# EAGLE design 202_9axis (EAGLE 9.6.2)
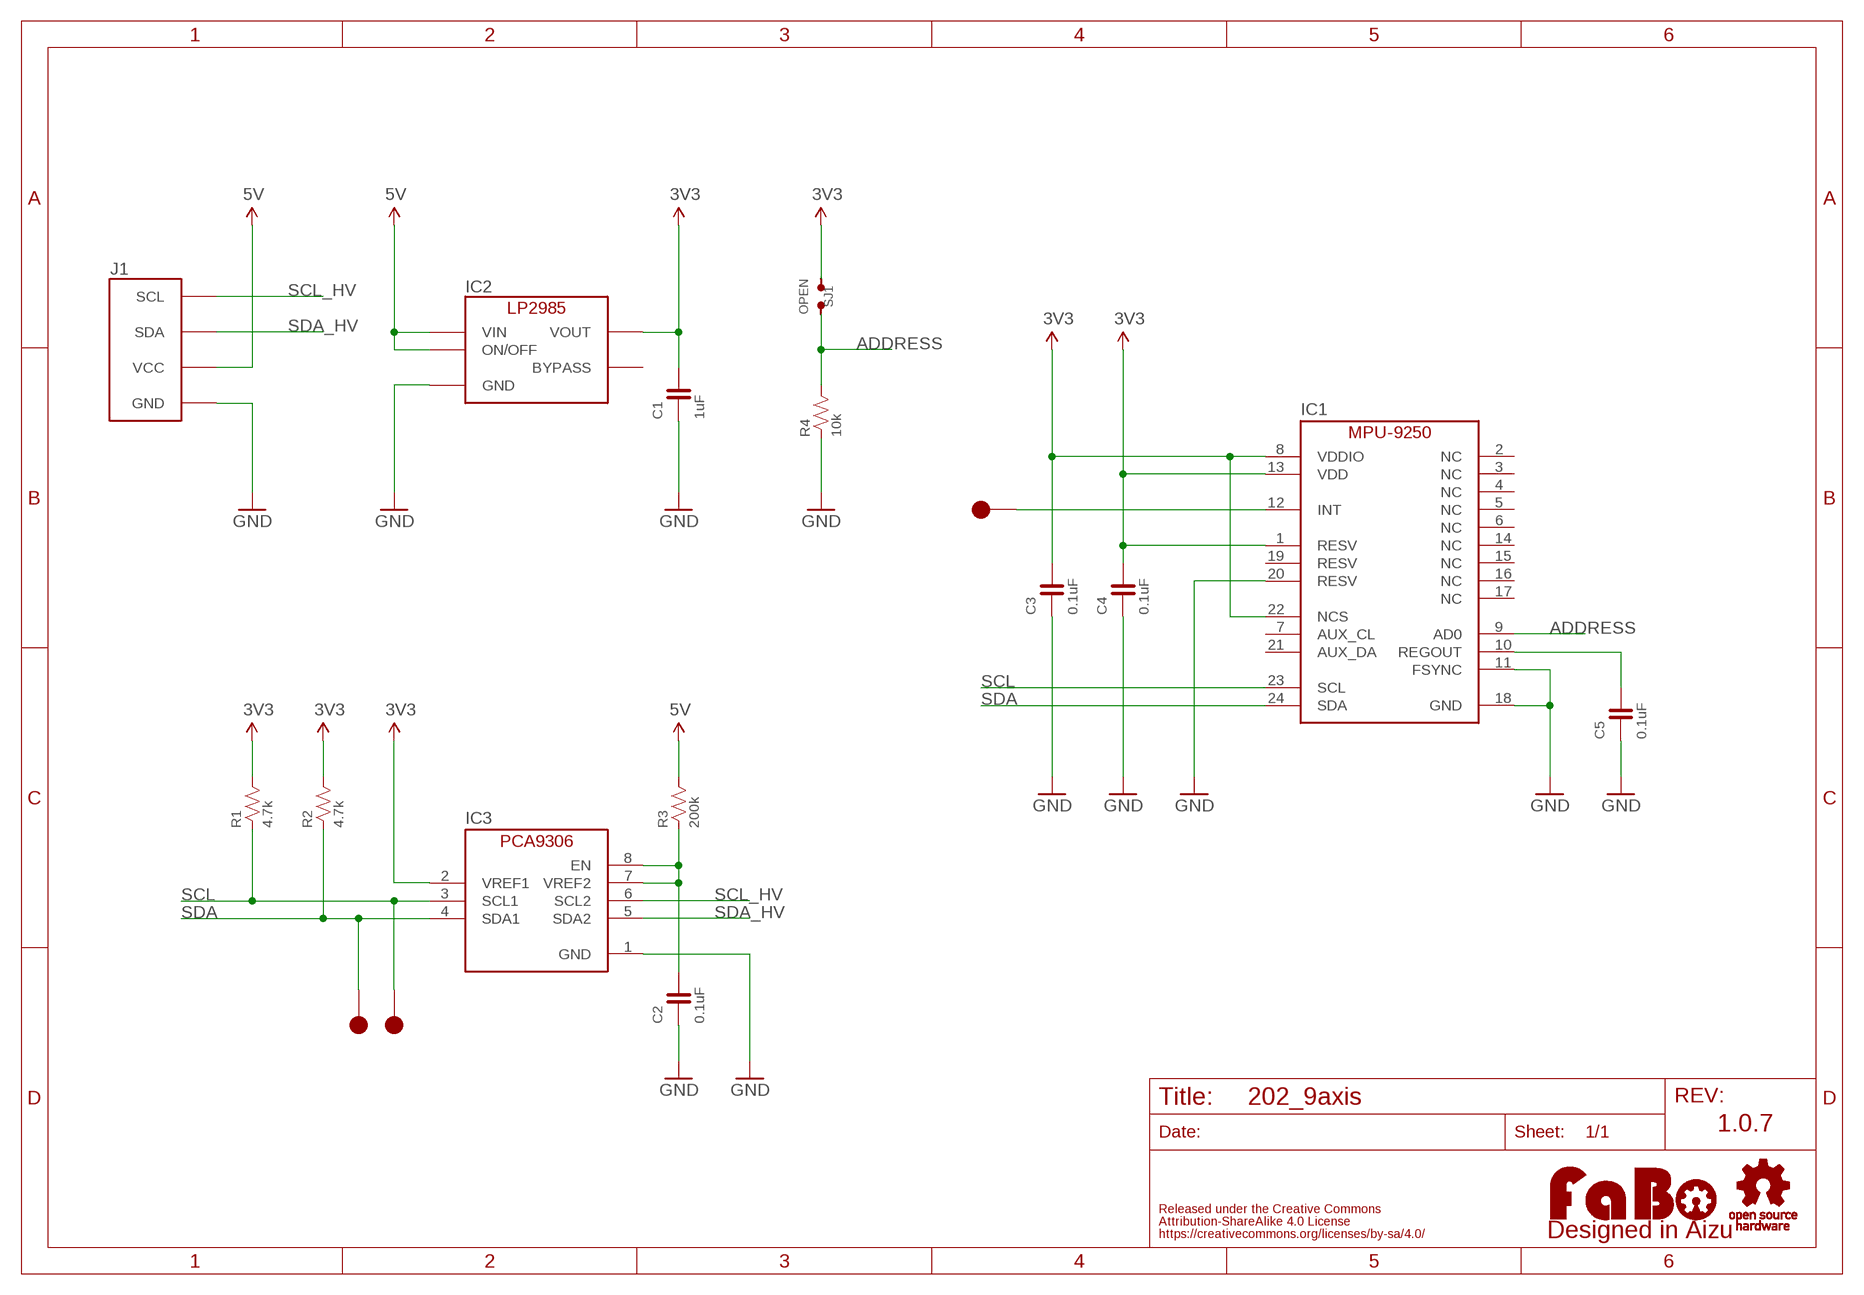
[diagram p0: schematic, sheet 1]

## Parts
C1  1uF  CAPACITOR-0603  [0603]
C2  0.1uF  CAPACITOR-0603  [0603]
C3  0.1uF  CAPACITOR-0603  [0603]
C4  0.1uF  CAPACITOR-0603  [0603]
C5  0.1uF  CAPACITOR-0603  [0603]
IC1  IS-MPU9250  [INVENSENSE-MPU9250]
IC2  LP2985-33DBV  [SOT-23-5]
IC3  PCA9306GM  [XQFN8]
J1  FABO_BRICK_I2C  [FABO_BRICK_I2C]
LOGO1  LOGO_FABO-M  [LOGO_FABO_M]
R1  4.7k  RESISTOR-0603  [0603]
R2  4.7k  RESISTOR-0603  [0603]
R3  200k  RESISTOR-0603  [0603]
R4  10k  RESISTOR-0603  [0603]
SJ1  OPEN  SMD-JUMPER-2-OPEN  [SMD-JUMPER-2-OPEN]
TP1  TP-15  [TP-15]
TP2  TP-15  [TP-15]
TP3  TP-15  [TP-15]
U$2  LOGO_OSHW-M_BOTTOM  [LOGO_OSHW_M_BOTTOM]

## Nets
3V3: C1.2 C3.2 C4.2 IC1.1(RESV) IC1.8(VDDIO) IC1.13(VDD) IC1.22(NCS) IC2.5(VOUT) IC3.2(VREF1) R1.2 R2.2 SJ1.1
5V: IC2.1(VIN) IC2.3(ON/OFF) J1.VCC R3.2
ADDRESS: IC1.9(AD0) R4.2 SJ1.2
GND: C1.1 C2.1 C3.1 C4.1 C5.1 IC1.11(FSYNC) IC1.18(GND) IC1.20(RESV) IC2.2(GND) IC3.1(GND) J1.GND R4.1
N$1: C2.2 IC3.7(VREF2) IC3.8(EN) R3.1
N$2: IC1.12(INT) TP3.1
REGOUT: C5.2 IC1.10(REGOUT)
SCL: IC1.23(SCL) IC3.3(SCL1) R1.1 TP2.1
SCL_HV: IC3.6(SCL2) J1.SCL
SDA: IC1.24(SDA) IC3.4(SDA1) R2.1 TP1.1
SDA_HV: IC3.5(SDA2) J1.SDA
Unconnected: IC1.2(NC) IC1.3(NC) IC1.4(NC) IC1.5(NC) IC1.6(NC) IC1.7(AUX_CL) IC1.14(NC) IC1.15(NC) IC1.16(NC) IC1.17(NC) IC1.19(RESV) IC1.21(AUX_DA) IC2.4(BYPASS)

## Notes on the sheet
- 1.0.7

## Library data of the parts
C1-C5 = FaBo-Capacitor:CAPACITOR: CAPACITOR
IC1 = FaBo-Mems:IS-MPU9250: INVENSENSE MPU9250(9axis)
IC2 = FaBo-Supply:LP2985: LP2985
IC3 = FaBo-LevelTranslator:PCA9306
J1 = FaBo-Template:FABO_BRICK_I2C: FaBo Brick I2C
LOGO1 = component:LOGO_FABO
R1-R4 = FaBo-Resistors:RESISTOR: RESISTOR
SJ1 = FaBo-Supply:SMD-JUMPER-2
TP1-TP3 = FaBo-Supply:TP
U$2 = FaBo-etc:LOGO_OSHW

## Board
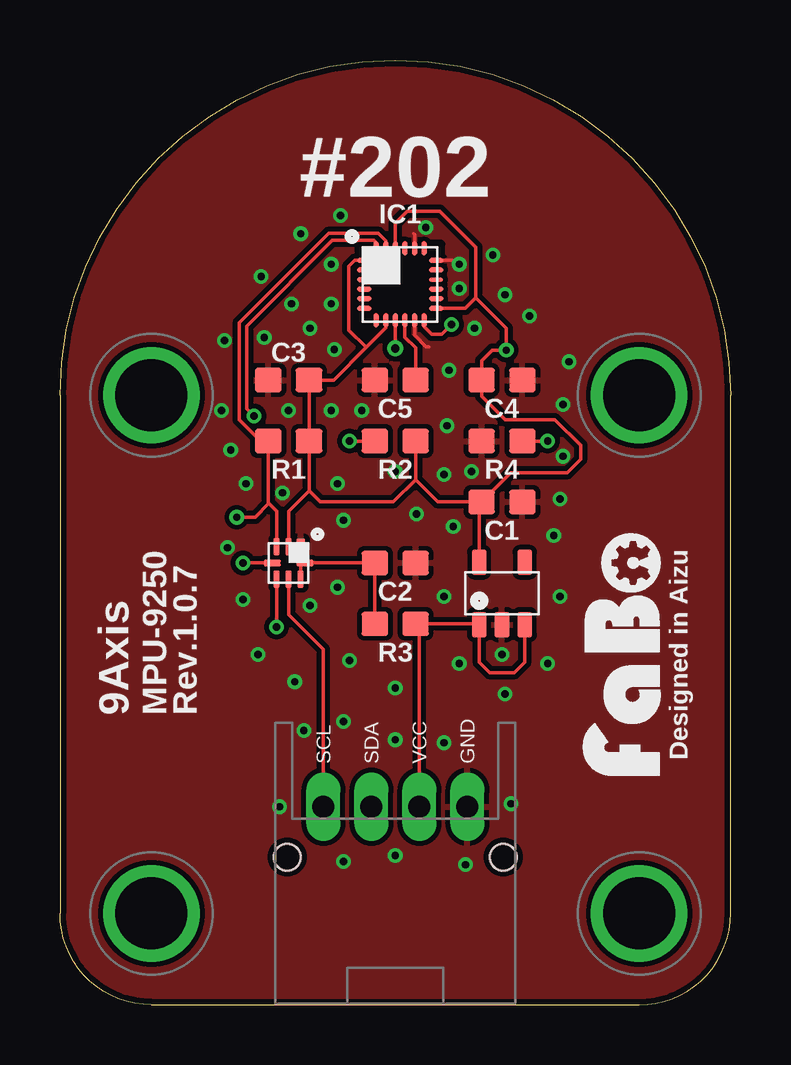
[diagram p1: board, top side]
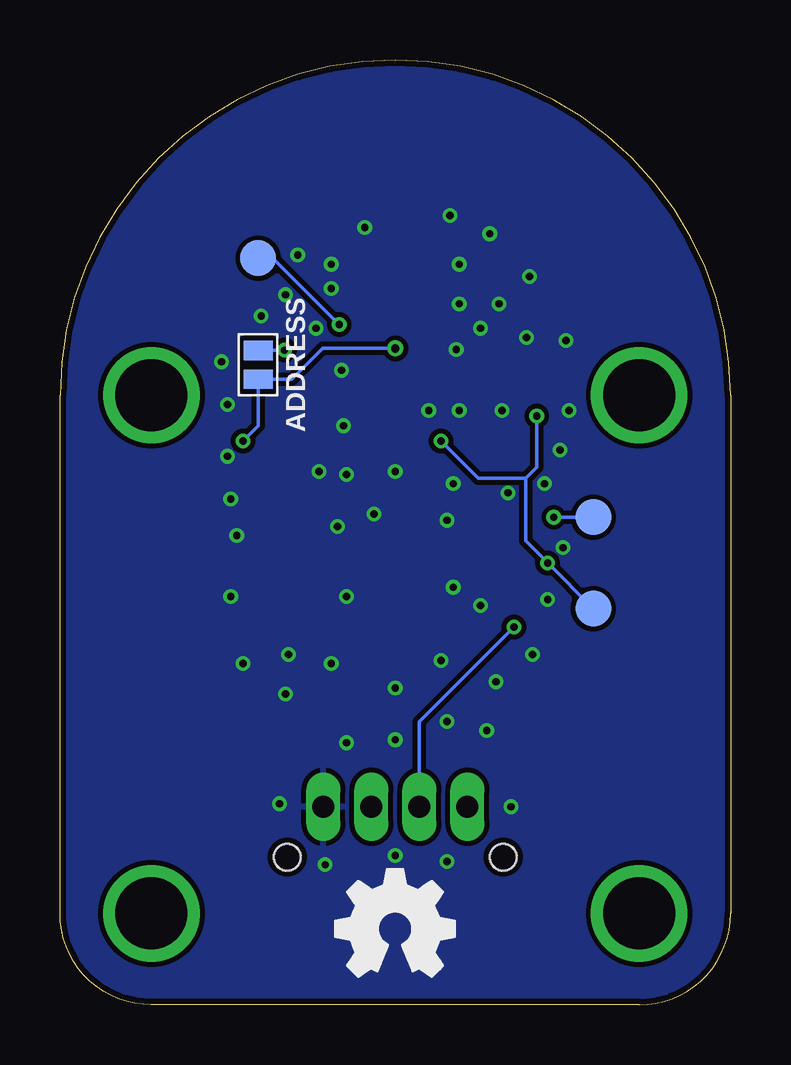
[diagram p2: board, bottom side, seen from below]

Size 27.94 x 39.37 mm. Coordinates in mm from the lower left corner, seen from the top.
Copper layers (1*16): Top 0.035mm / dielectric 1.6mm / Bottom 0.035mm
Design rules "PCBway": minimum track width 6mil, minimum drill 12mil, track to track 6mil, track to pad 6mil, pad to pad 6mil, via to via 6mil, smd to smd 6mil, copper to edge 10mil, drill to drill 10mil, minimum pad ring 10mil, minimum via ring 6mil, stop-mask expansion 2mil, vias tented up to drill 100mil, thermal gap 8mil

### Footprints (pad centres in the part's own frame; a part is rotated, then mirrored left to right if it is on the bottom)
0603 = smd 1.1 x 1: 1 -0.85,0; 2 0.85,0
INVENSENSE-MPU9250 = smd 0.6 x 0.2: 1 -1.5,1; 2 -1.5,0.6; 3 -1.5,0.2; 4 -1.5,-0.2; 5 -1.5,-0.6; 6 -1.5,-1; 13 1.5,-1; 14 1.5,-0.6; 15 1.5,-0.2; 16 1.5,0.2; 17 1.5,0.6; 18 1.5,1 | smd 0.2 x 0.6: 7 -1,-1.5; 8 -0.6,-1.5; 9 -0.2,-1.5; 10 0.2,-1.5; 11 0.6,-1.5; 12 1,-1.5; 19 1,1.5; 20 0.6,1.5; 21 0.2,1.5; 22 -0.2,1.5; 23 -0.6,1.5; 24 -1,1.5
SOT-23-5 = smd 0.6 x 1.05: 1 -0.95,-1.3; 2 0,-1.3; 3 0.95,-1.3; 4 0.95,1.3; 5 -0.95,1.3
XQFN8 = smd 0.7 x 0.35: 1 -0.675,0.5 | smd 0.7 x 0.25: 2 -0.675,0; 3 -0.675,-0.5; 5 0.675,-0.5; 6 0.675,0; 7 0.675,0.5 | smd 0.25 x 0.7: 4 0,-0.675; 8 0,0.675
FABO_BRICK_I2C = drill 0.9 pad 1.422 long: GND 3,-10.795; SCL -3,-10.795; SDA -1,-10.795; VCC 1,-10.795 | drill 3 pad 3.81: P$1 -10.16,6.35; P$2 10.16,6.35; P$3 -10.16,-15.24; P$4 10.16,-15.24 | hole 1.1: -4.5,-12.895; 4.5,-12.895
SMD-JUMPER-2-OPEN = smd 0.8 x 1.2: 1 -0.6,0; 2 0.6,0
TP-15 = smd 1.5 x 1.5: 1 0,0

### Placement (x,y rotation side)
C1  18.41,20.95 180 top
C2  13.97,18.41 180 top
C3  9.53,26.04 0 top
C4  18.41,26.04 180 top
C5  13.97,26.04 0 top
IC1  14.17,30.02 0 top
IC2  18.41,17.14 0 top
IC3  9.53,18.41 270 top
J1  13.97,19.05 0 top
LOGO1  25.4,14.61 90 top
R1  9.53,23.5 0 top
R2  13.97,23.5 0 top
R3  13.97,15.88 0 top
R4  18.41,23.5 0 top
SJ1  19.68,26.67 270 bottom
TP1  5.71,16.51 0 bottom
TP2  5.71,20.32 0 bottom
TP3  19.68,31.11 0 bottom
U$2  13.97,3.17 0 top

### Tracks (layer width: path | path; a pad name or v marks a point on that pad's centre or on a via)
3V3  (via drill 0.3)
  Top 0.152: C1.2 15.75,20.95 14.82,21.88 | R2.2 14.82,21.88 | IC2.5 17.46,20.86 C1.2 | 10.38,21.42 R1.2 C3.2 11.4,26.04 12.76,27.39 | 14.82,21.88 13.89,20.95 10.84,20.95 10.38,21.42 | IC3.2 9.53,20.57 10.38,21.42 | 12.76,27.39 12.04,28.12 12.04,30.79 12.28,31.02 IC1.1 | 17.32,29.46 17.32,31.57 15.82,33.07 14.48,33.07 13.97,32.57 IC1.22 | C1.2 18.78,22.17 21.13,22.17 21.69,22.73 21.69,23.32 20.62,24.38 18.54,24.38 17.57,25.36 C4.2 | C4.2 17.53,26.06 | C4.2 17.57,26.84 18.01,27.28 v18.59,27.28 18.59,28.19 17.32,29.46 | IC1.8 13.57,28.2 12.76,27.39 | IC1.13 16.88,29.02 17.32,29.46
  Bottom 0.152: SJ1.1 v18.59,27.28
5V
  Top 0.152: R3.2 14.99,15.88 | 14.99,15.88 17.43,15.88 IC2.1 17.46,14.29 17.91,13.84 18.92,13.84 19.36,14.29 IC2.3 | 14.99,15.88 14.97,15.86 J1.VCC
ADDRESS  (via drill 0.3, 0.35)
  Top 0.152: v20.32,23.5 R4.2 | IC1.9 v13.97,27.36
  Bottom 0.152: v20.32,23.5 19.68,24.13 SJ1.2 18.28,26.07 16.99,27.36 v13.97,27.36
GND  (via drill 0.3)
  Top 0.152: IC1.18 16.35,31.02 16.38,30.99 | IC1.20 14.77,32.09 14.73,32.13 | IC1.11 14.77,27.9 15.24,27.43 15.37,27.43
  other vias: 16.64,29.84 18.03,31.24 16.21,26.44 8.38,30.35 8.51,27.81 10.03,32.13 11.68,32.89 15.24,32.38 18.54,29.59 6.73,24.77 12.57,24.77 13.97,22.23 11.56,21.72 7.75,21.72 11.81,20.19 6.99,19.05 7.62,16.89 11.56,17.4 9.78,13.46 12.06,14.35 11.81,11.81 10.16,11.43 13.97,11.05 16,10.92 16.64,14.22 18.54,12.95 16,17.02 16.38,19.94 20.57,19.56 20.83,17.02 20.95,22.86 16,22.1 16.13,24.13 20.95,25.02 20.83,21.08 17.14,22.23 14.86,20.45 11.3,24.77 9.53,24.77 9.27,21.34 18.41,14.61 20.32,14.22 16.64,30.86 17.27,28.19 19.56,28.7 21.21,26.8 11.43,27.3 7.11,23.11 8.26,14.61 10.41,16.64 13.97,13.21 16.89,5.84 13.97,6.22 11.81,5.97 9.14,8.26 18.8,8.38 9.65,29.21 6.86,27.69 11.3,30.86 11.3,29.21 10.41,28.19
  pour Bottom (isolate 0.203): 0,0 27.94,0 27.94,39.37 0,39.37
  pour Top (isolate 0.203): 0,0 27.94,0 27.94,39.37 0,39.37
N$1
  Top 0.152: IC3.7 10.03,18.41 IC3.8 C2.2 R3.1
N$2  (via drill 0.3)
  Top 0.152: IC1.12 15.17,28.26 15.49,27.94 15.9,27.94 v16.31,28.35
  Bottom 0.152: v16.31,28.35 19.05,31.09 19.66,31.09 TP3.1
REGOUT
  Top 0.152: C5.2 14.82,27.37 14.37,27.82 IC1.10
SCL  (via drill 0.3)
  Top 0.152: IC3.3 9.03,20.57 8.7,20.89 | 8.7,20.89 8.68,20.92 R1.1 8.36,23.5 7.47,24.38 7.47,28.42 11.2,32.16 13.26,32.16 13.57,31.84 IC1.23 | v7.37,20.32 8.13,20.32 8.7,20.89
  Bottom 0.152: TP2.1 v7.37,20.32
SCL_HV
  Top 0.152: IC3.6 9.53,16.26 10.97,14.81 J1.SCL
SDA  (via drill 0.3)
  Top 0.152: v8.08,24.54 7.77,24.84 7.77,28.27 11.35,31.85 13.08,31.85 13.17,31.76 IC1.24 | IC3.4 v7.62,18.41 | R2.1 v12.06,23.5
  Bottom 0.152: v8.08,24.54 8.08,22.4 8.53,21.95 | TP1.1 v7.62,18.41 8.53,19.33 8.53,21.95 | v12.06,23.5 10.52,21.95 8.53,21.95
SDA_HV  (via drill 0.3)
  Top 0.152: IC3.5 v9.03,15.76 v9.02,15.75
  Bottom 0.152: J1.SDA 12.97,11.79 v9.02,15.75

### Text on the board
tPlace: #202 | Designed in Aizu | 9Axis | MPU-9250 | Rev.1.0.7
bPlace: ADDRESS